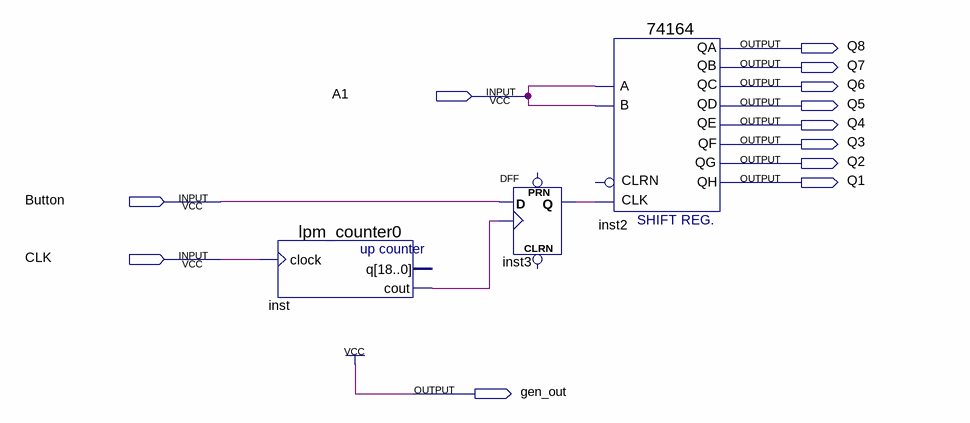
[diagram p0: schematic sheet]
// Quartus schematic 31.bdf as structural Verilog: 3 symbols, 12 pins
module \31  (
  input  A1,
  input  Button,
  input  CLK,
  output Q8,
  output Q7,
  output Q6,
  output Q5,
  output Q4,
  output Q3,
  output Q2,
  output Q1,
  output gen_out
);

  wire inst3_q, inst_cout;

  lpm_counter0 inst (.clock(CLK), .cout(inst_cout));  // open: q
  DFF inst3 (.CLK(inst_cout), .D(Button), .Q(inst3_q));  // open: CLRN, PRN
  \74164  inst2 (
    .CLK(inst3_q), .B(A1), .A(A1), .QD(Q5), .QC(Q6), .QA(Q8), .QF(Q3), .QH(Q1), .QG(Q2), .QE(Q4), .QB(Q7));  // open: CLRN

  assign gen_out = 1'b1;
endmodule
